# Altium schematic sheet s4.SchDoc
size B
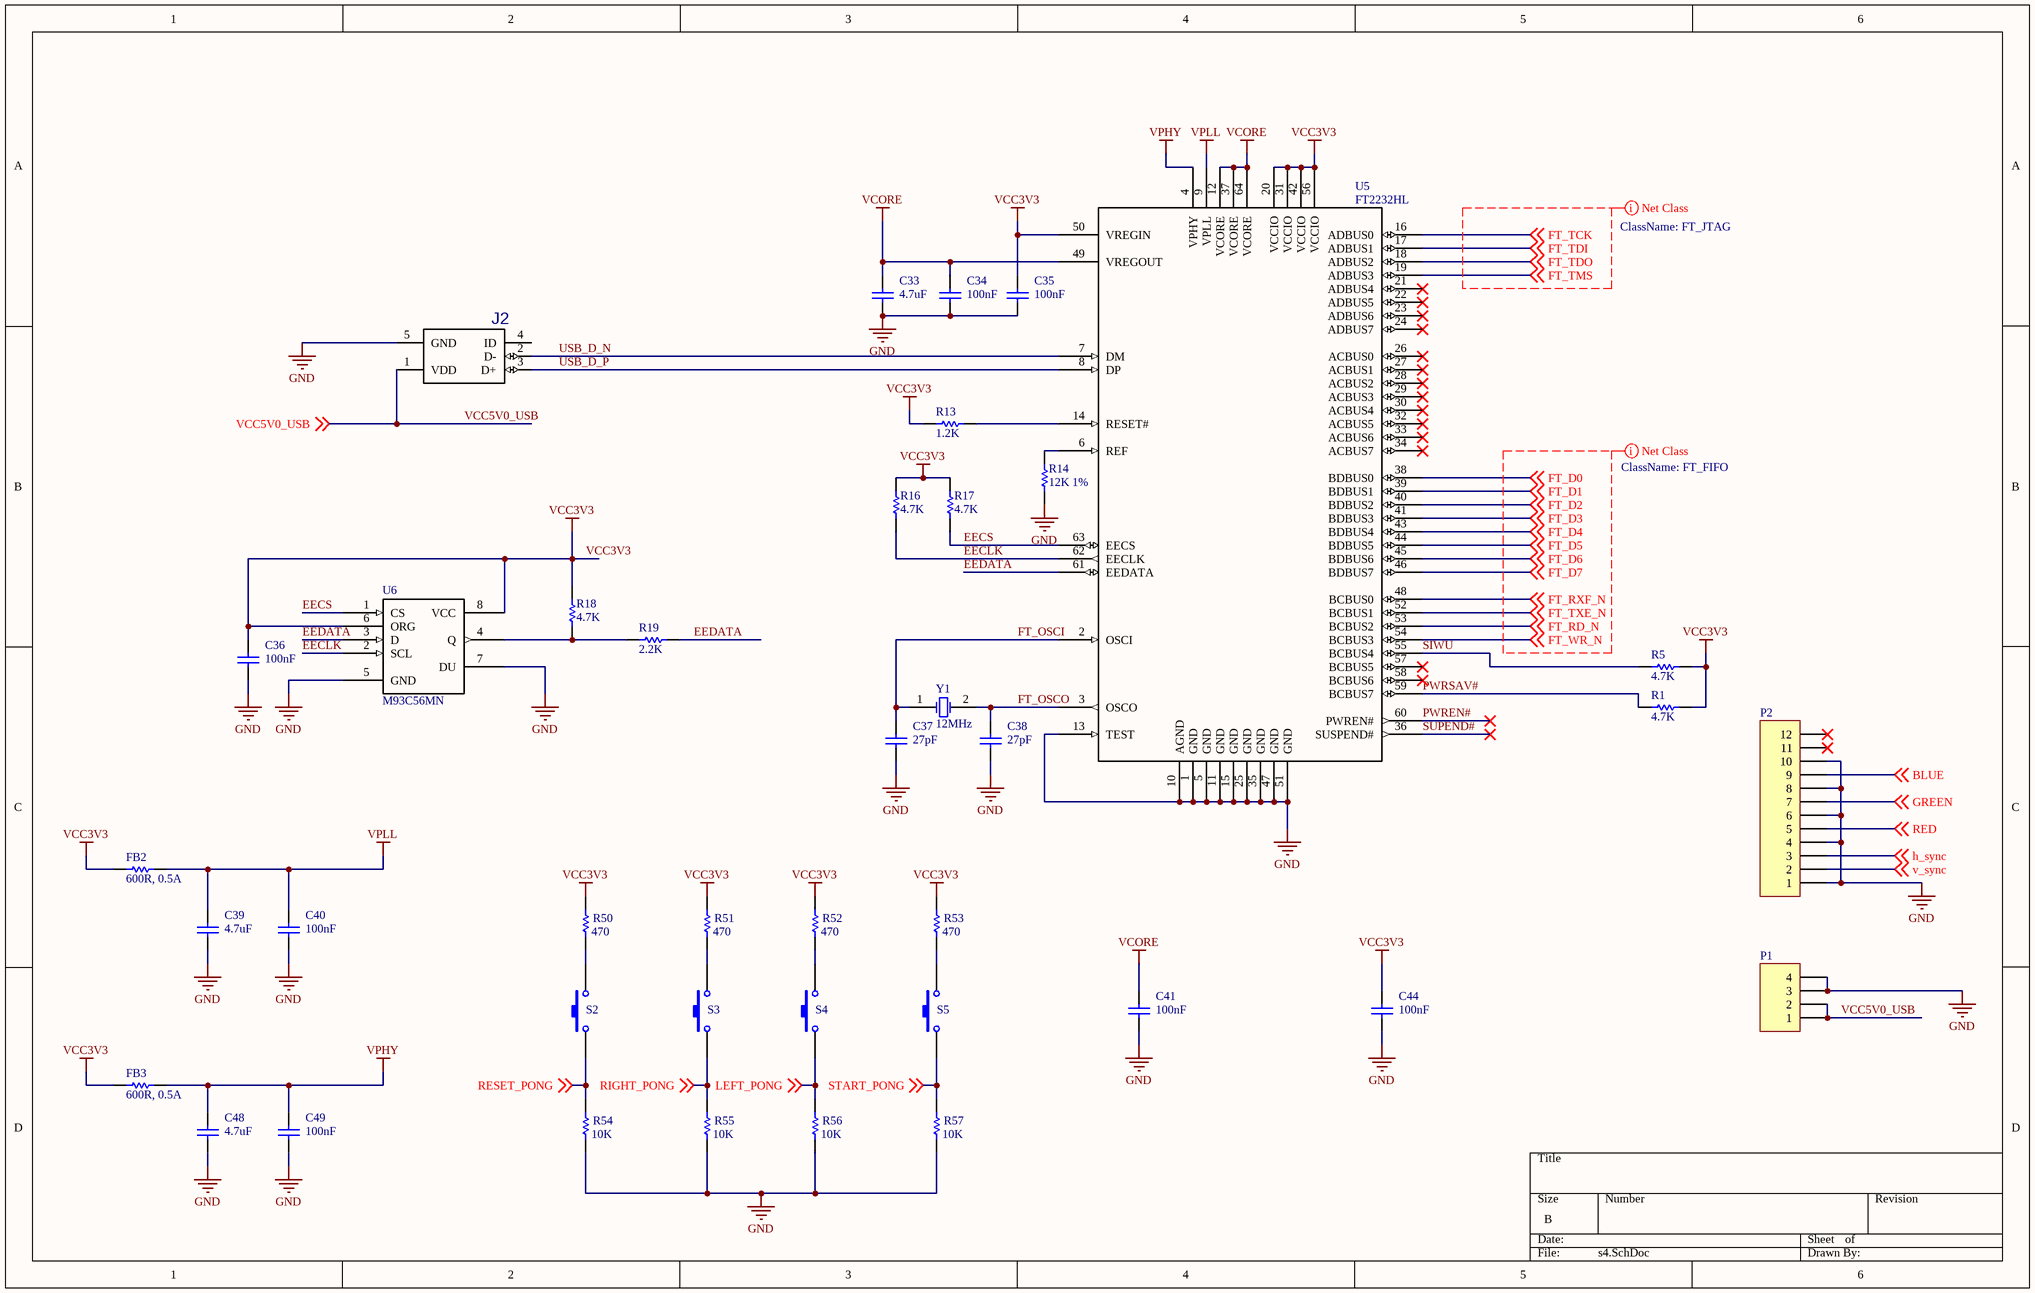
[diagram p0: s4.SchDoc]

## Parts
C33  value 4.7uF  [0805 CAP]  (hidden comment: Cap)
C34  value 100nF  [0805 CAP]  (hidden comment: Cap)
C35  value 100nF  [0805 CAP]  (hidden comment: Cap)
C36  value 100nF  [0805 CAP]  (hidden comment: 27pF)
C37  27pF  [0805 CAP]
C38  value 27pF  [0805 CAP]  (hidden comment: Cap)
C39  value 4.7uF  [0805 CAP]  (hidden comment: 27pF)
C40  value 100nF  [0805 CAP]  (hidden comment: 27pF)
C41  value 100nF  [0805 CAP]  (hidden comment: Cap)
C44  value 100nF  [0805 CAP]  (hidden comment: Cap)
C48  value 4.7uF  [0805 CAP]  (hidden comment: 27pF)
C49  value 100nF  [0805 CAP]  (hidden comment: 27pF)
FB2  value 600R, 0.5A  [0805 RES]  (hidden comment: Res1)
FB3  value 600R, 0.5A  [0805 RES]  (hidden comment: Res1)
J2  105017-0001  [MOLEX_105017-0001]  (value not drawn)
P1  MHDR1X4  [4 PIN]  (value not drawn)
P2  MHDR1X12  [12 PIN]  (value not drawn)
R1  value 4.7K  [0805 RES]  (hidden comment: Res1)
R5  value 4.7K  [0805 RES]  (hidden comment: Res1)
R13  value 1.2K  [0805 RES]  (hidden comment: Res1)
R14  value 12K 1%  [0805 RES]  (hidden comment: Res1)
R16  value 4.7K  [0805 RES]  (hidden comment: Res1)
R17  value 4.7K  [0805 RES]  (hidden comment: Res1)
R18  value 4.7K  [0805 RES]  (hidden comment: Res1)
R19  value 2.2K  [0805 RES]  (hidden comment: Res1)
R50  value 470  [0805 RES]  (hidden comment: Res1)
R51  value 470  [0805 RES]  (hidden comment: Res1)
R52  value 470  [0805 RES]  (hidden comment: Res1)
R53  value 470  [0805 RES]  (hidden comment: Res1)
R54  value 10K  [0805 RES]  (hidden comment: Res1)
R55  value 10K  [0805 RES]  (hidden comment: Res1)
R56  value 10K  [0805 RES]  (hidden comment: Res1)
R57  value 10K  [0805 RES]  (hidden comment: Res1)
S2  SW-PB  [Tack Switch]  (value not drawn)
S3  SW-PB  [Tack Switch]  (value not drawn)
S4  SW-PB  [Tack Switch]  (value not drawn)
S5  SW-PB  [Tack Switch]  (value not drawn)
U5  FT2232HL  [LQFP64]
U6  M93C56MN  [SOIC127P600X175-8N]
Y1  12MHz  [XTAL1170X500X450]

## Nets
GND: C33.1 C34.1 C35.1 C36.1 C37.1 C38.1 C39.1 C40.1 C41.1 C44.1 C48.1 C49.1 J2.5(GND) P1.3 P1.4 P2.1 P2.4 P2.6 P2.8 P2.10 R14.2 R54.1 R55.1 R56.1 R57.1 U5.1(GND) U5.5(GND) U5.10(AGND) U5.11(GND) U5.13(TEST) U5.15(GND) U5.25(GND) U5.35(GND) U5.47(GND) U5.51(GND) U6.5(GND) U6.7(DU)
VCC3V3: C35.2 C36.2 C44.2 FB2.2 FB3.2 R1.1 R5.1 R13.2 R16.1 R17.1 R18.1 R50.2 R51.2 R52.2 R53.2 U5.20(VCCIO) U5.31(VCCIO) U5.42(VCCIO) U5.50(VREGIN) U5.56(VCCIO) U6.6(ORG) U6.8(VCC)
VCORE: C33.2 C34.2 C41.2 U5.12(VCORE) U5.37(VCORE) U5.49(VREGOUT) U5.64(VCORE)
VPHY: C48.2 C49.2 FB3.1 U5.4(VPHY)
VPLL: C39.2 C40.2 FB2.1 U5.9(VPLL)
BLUE: P2.9 ; off-sheet BLUE
EECLK: R16.2 U5.62(EECLK) U6.2(SCL)
EECS: R17.2 U5.63(EECS) U6.1(CS)
EEDATA: R19.2 U5.61(EEDATA) U6.3(D)
FT_D0: U5.38(BDBUS0) ; off-sheet FT_D0
FT_D1: U5.39(BDBUS1) ; off-sheet FT_D1
FT_D2: U5.40(BDBUS2) ; off-sheet FT_D2
FT_D3: U5.41(BDBUS3) ; off-sheet FT_D3
FT_D4: U5.43(BDBUS4) ; off-sheet FT_D4
FT_D5: U5.44(BDBUS5) ; off-sheet FT_D5
FT_D6: U5.45(BDBUS6) ; off-sheet FT_D6
FT_D7: U5.46(BDBUS7) ; off-sheet FT_D7
FT_OSCI: C37.2 U5.2(OSCI) Y1.1(OSC1)
FT_OSCO: C38.2 U5.3(OSCO) Y1.2(OSC2)
FT_RD_N: U5.53(BCBUS2) ; off-sheet FT_RD_N
FT_RXF_N: U5.48(BCBUS0) ; off-sheet FT_RXF_N
FT_TCK: U5.16(ADBUS0) ; off-sheet FT_TCK
FT_TDI: U5.17(ADBUS1) ; off-sheet FT_TDI
FT_TDO: U5.18(ADBUS2) ; off-sheet FT_TDO
FT_TMS: U5.19(ADBUS3) ; off-sheet FT_TMS
FT_TXE_N: U5.52(BCBUS1) ; off-sheet FT_TXE_N
FT_WR_N: U5.54(BCBUS3) ; off-sheet FT_WR_N
GREEN: P2.7 ; off-sheet GREEN
h_sync: P2.3 ; off-sheet h_sync
LEFT_PONG: R56.2 S4.1 ; off-sheet LEFT_PONG
PWREN#: U5.60(PWREN#)
PWRSAV#: R1.2 U5.59(BCBUS7)
RED: P2.5 ; off-sheet RED
RESET_PONG: R54.2 S2.1 ; off-sheet RESET_PONG
RIGHT_PONG: R55.2 S3.1 ; off-sheet RIGHT_PONG
SIWU: R5.2 U5.55(BCBUS4)
START_PONG: R57.2 S5.1 ; off-sheet START_PONG
SUPEND#: U5.36(SUSPEND#)
USB_D_N: J2.2(D-) U5.7(DM)
USB_D_P: J2.3(D+) U5.8(DP)
v_sync: P2.2 ; off-sheet v_sync
VCC5V0_USB: J2.1(VDD) P1.1 P1.2 ; off-sheet VCC5V0_USB
NetR13_1: R13.1 U5.14(RESET#)
NetR14_1: R14.1 U5.6(REF)
NetR18_2: R18.2 R19.1 U6.4(Q)
NetR50_1: R50.1 S2.2
NetR51_1: R51.1 S3.2
NetR52_1: R52.1 S4.2
NetR53_1: R53.1 S5.2

Not connected (* = marked no-connect by the designer): J2 4(ID); P2 11* 12*; U5 21(ADBUS4)* 22(ADBUS5)* 23(ADBUS6)* 24(ADBUS7)* 26(ACBUS0)* 27(ACBUS1)* 28(ACBUS2)* 29(ACBUS3)* 30(ACBUS4)* 32(ACBUS5)* 33(ACBUS6)* 34(ACBUS7)* 57(BCBUS5)* 58(BCBUS6)*

## Layout directives
net class FT_JTAG: FT_TCK, FT_TDI, FT_TDO, FT_TMS
net class FT_FIFO: FT_D0, FT_D1, FT_D2, FT_D3, FT_D4, FT_D5, FT_D6, FT_D7, FT_RD_N, FT_RXF_N, FT_TXE_N, FT_WR_N

## Library data of the parts
C33-C41 C44 C48 C49 = Cap: Capacitor; Published: 8-Jun-2000; LatestRevisionDate: 17-Jul-2002; LatestRevisionNote: Re-released for DXP Platform.; PackageReference: RAD-0.3; Publisher: Altium Limited; PackageDescription: Radial Cap, Thru-Hole; 2 Leads; 0.3 in Pin Spacing
  C37: Value: 27pF
FB2 FB3 R1 R5 R13 R14 R16-R19 R50-R57 = Res1: Resistor; Published: 8-Jun-2000; LatestRevisionDate: 17-Jul-2002; LatestRevisionNote: Re-released for DXP Platform.; PackageReference: AXIAL-0.3; Publisher: Altium Limited; PackageDescription: Axial Device, Thru-Hole; 2 Leads; 0.3 in Pin Spacing
J2 = 105017-0001: Conn USB Type B M 5 POS 0.65mm Solder RA Thru-Hole 5 Terminal 1 Port Embossed T/R; MF: Molex; Price: 0.47 USD; Availability: Good; Package: None; MP: 105017-0001; Value: *
P1 = MHDR1X4: Header, 4-Pin; LatestRevisionDate: 17-Jul-2002; LatestRevisionNote: Re-released for DXP Platform.; Publisher: Altium Limited
P2 = MHDR1X12: Header, 12-Pin; LatestRevisionDate: 17-Jul-2002; LatestRevisionNote: Re-released for DXP Platform.; Publisher: Altium Limited
S2-S5 = SW-PB: Switch; pin to pad: 2>3; Published: 24-Mar-1999; LatestRevisionDate: 17-Jul-2002; LatestRevisionNote: Re-released for DXP Platform.; PackageReference: SPST-2; Publisher: Altium Limited; PackageDescription: Switch; 2 Leads
Y1 = XTAL: Crystal Oscillator; Published: 8-Jun-2000; LatestRevisionDate: 17-Jul-2002; LatestRevisionNote: Re-released for DXP Platform.; PackageReference: R38; Publisher: Altium Limited; PackageDescription: Crystal, Thru-Hole; 2 Leads; Body 3.1 x 8.2 mm (Dia.xH)